# EAGLE design RGBW_LED-Band_Treiber_ungueltig (EAGLE 6.1)

## Sheet 1 of 2
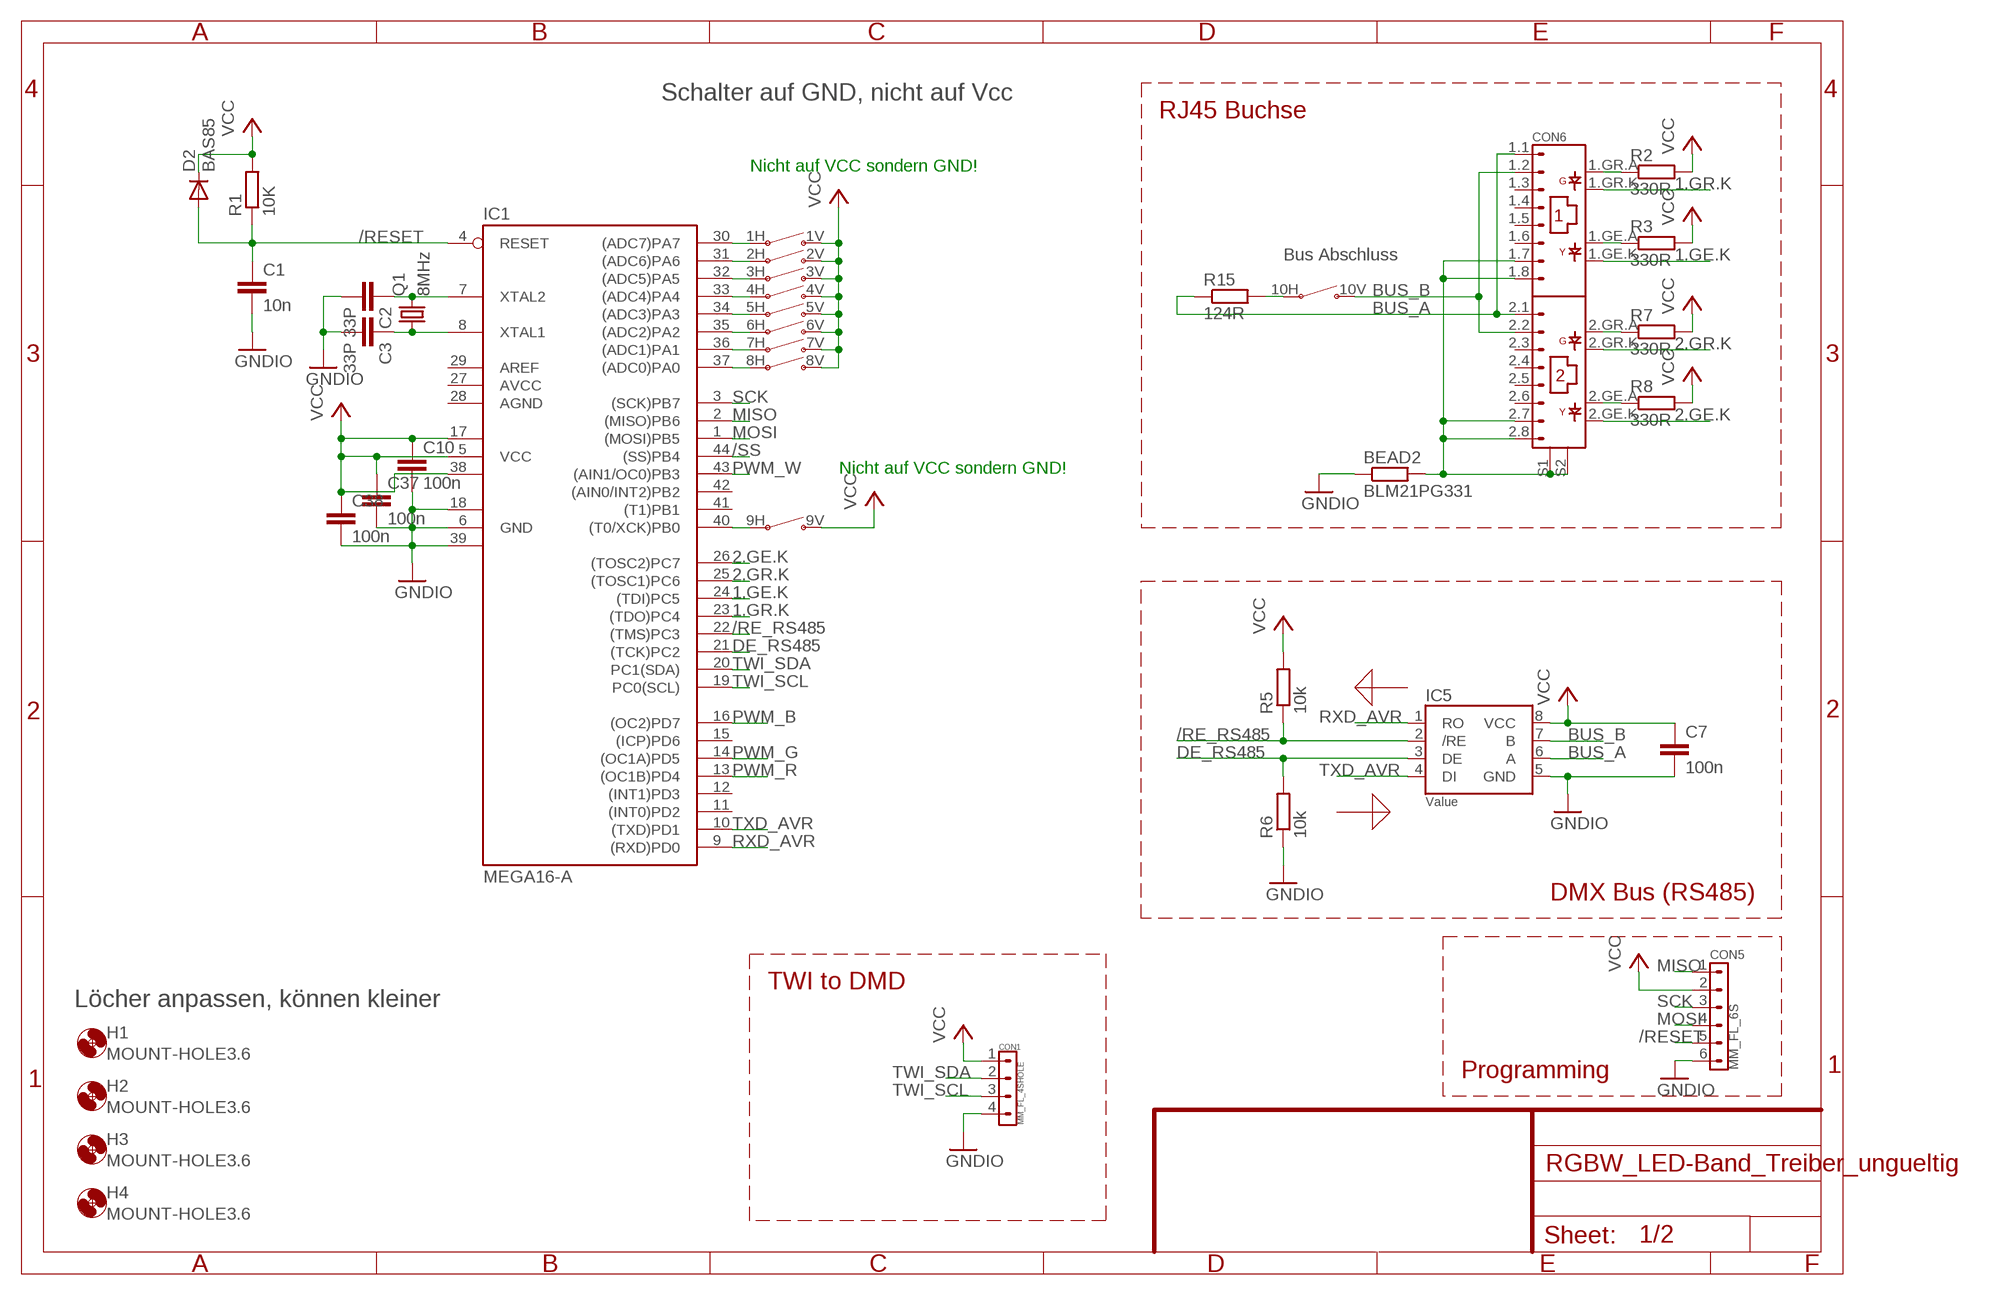
[diagram p0: schematic, sheet 1]

### Parts
BEAD2  BLM21PG331  R-EU_R0805  [R0805]
C1  10n  C-EUC0805  [C0805]
C2  33P  C-EUC0805  [C0805]
C3  33P  C-EUC0805  [C0805]
C7  100n  C-EUC0805  [C0805]
C10  100n  C-EUC0805  [C0805]
C37  100n  C-EUC0805  [C0805]
C38  100n  C-EUC0805  [C0805]
CON1  MM_FL_4SHOLE  [MM_FL_4G]
CON5  MM_FL_6S  MM_FL_6STH  [MM_FL_6G]
CON6  RJ45_2ER_LED  [RJ45_2ER_LED]
D2  BAS85  DIODE-SOD80C  [SOD80C]
H1  MOUNT-HOLE3.6  [3,6]
H2  MOUNT-HOLE3.6  [3,6]
H3  MOUNT-HOLE3.6  [3,6]
H4  MOUNT-HOLE3.6  [3,6]
IC1  MEGA16-A  [TQFP44]
IC5  LT1785  [SO08]
Q1  8MHz  CRYTALHC49S  [HC49/S]
R1  10K  R-EU_R0805  [R0805]
R2  330R  R-EU_R0805  [R0805]
R3  330R  R-EU_R0805  [R0805]
R5  10k  R-EU_R0805  [R0805]
R6  10k  R-EU_R0805  [R0805]
R7  330R  R-EU_R0805  [R0805]
R8  330R  R-EU_R0805  [R0805]
R15  124R  R-EU_R0805  [R0805]
S1  DIP-SCHALTERPIANO  [DP_10]

### Nets
1.GE.K: CON6.1.GE.K IC1.24((TDI)PC5)
1.GR.K: CON6.1.GR.K IC1.23((TDO)PC4)
2.GE.K: CON6.2.GE.K IC1.26((TOSC2)PC7)
2.GR.K: CON6.2.GR.K IC1.25((TOSC1)PC6)
/RE_RS485: IC1.22((TMS)PC3) IC5.2(/RE) R5.1
/RESET: C1.1 CON5.5 D2.A IC1.4(RESET) R1.1
/SS: IC1.44((SS)PB4)
BUS_A: CON6.1.1 CON6.2.1 IC5.6(A) R15.1
BUS_B: CON6.1.2 CON6.2.2 IC5.7(B) S1.10V
DE_RS485: IC1.21((TCK)PC2) IC5.3(DE) R6.2
GNDIO: BEAD2.1 C1.2 C2.2 C3.2 C7.2 C10.2 C37.2 C38.2 CON1.4 CON5.6 IC1.6(GND) IC1.18(GND1) IC1.39(GND2) IC5.5(GND) R6.1 ; also sheet 2
MISO: CON5.1 IC1.2((MISO)PB6)
MOSI: CON5.4 IC1.1((MOSI)PB5)
N$1: C3.1 IC1.8(XTAL1) Q1.1
N$2: C2.1 IC1.7(XTAL2) Q1.2
N$3: IC1.30((ADC7)PA7) S1.1H
N$4: IC1.31((ADC6)PA6) S1.2H
N$5: IC1.32((ADC5)PA5) S1.3H
N$7: IC1.33((ADC4)PA4) S1.4H
N$8: IC1.34((ADC3)PA3) S1.5H
N$9: IC1.35((ADC2)PA2) S1.6H
N$10: IC1.36((ADC1)PA1) S1.7H
N$11: IC1.37((ADC0)PA0) S1.8H
N$13: BEAD2.2 CON6.1.7 CON6.1.8 CON6.2.7 CON6.2.8 CON6.S1 CON6.S2
N$14: CON6.1.GR.A R2.1
N$16: CON6.1.GE.A R3.1
N$18: CON6.2.GR.A R7.1
N$20: CON6.2.GE.A R8.1
N$25: IC1.40((T0/XCK)PB0) S1.9H
N$27: R15.2 S1.10H
PWM_B: IC1.16((OC2)PD7) ; also sheet 2
PWM_G: IC1.14((OC1A)PD5) ; also sheet 2
PWM_R: IC1.13((OC1B)PD4) ; also sheet 2
PWM_W: IC1.43((AIN1/OC0)PB3) ; also sheet 2
RXD_AVR: IC1.9((RXD)PD0) IC5.1(RO)
SCK: CON5.3 IC1.3((SCK)PB7)
TWI_SCL: CON1.3 IC1.19(PC0(SCL))
TWI_SDA: CON1.2 IC1.20(PC1(SDA))
TXD_AVR: IC1.10((TXD)PD1) IC5.4(DI)
VCC: C7.1 C10.1 C37.1 C38.1 CON1.1 CON5.2 D2.C IC1.5(VCC) IC1.17(VCC1) IC1.38(VCC2) IC5.8(VCC) R1.2 R2.2 R3.2 R5.2 R7.2 R8.2 S1.1V S1.2V S1.3V S1.4V S1.5V S1.6V S1.7V S1.8V S1.9V ; also sheet 2
Unconnected: CON6.1.3 CON6.1.4 CON6.1.5 CON6.1.6 CON6.2.3 CON6.2.4 CON6.2.5 CON6.2.6 IC1.11((INT0)PD2) IC1.12((INT1)PD3) IC1.15((ICP)PD6) IC1.41((T1)PB1) IC1.42((AIN0/INT2)PB2)

### Notes on the sheet
- Schalter auf GND, nicht auf Vcc
- RJ45 Buchse
- Nicht auf VCC sondern GND!
- Bus Abschluss
- Nicht auf VCC sondern GND!
- DMX Bus (RS485)
- TWI to DMD
- Löcher anpassen, können kleiner
- Programming

## Sheet 2 of 2
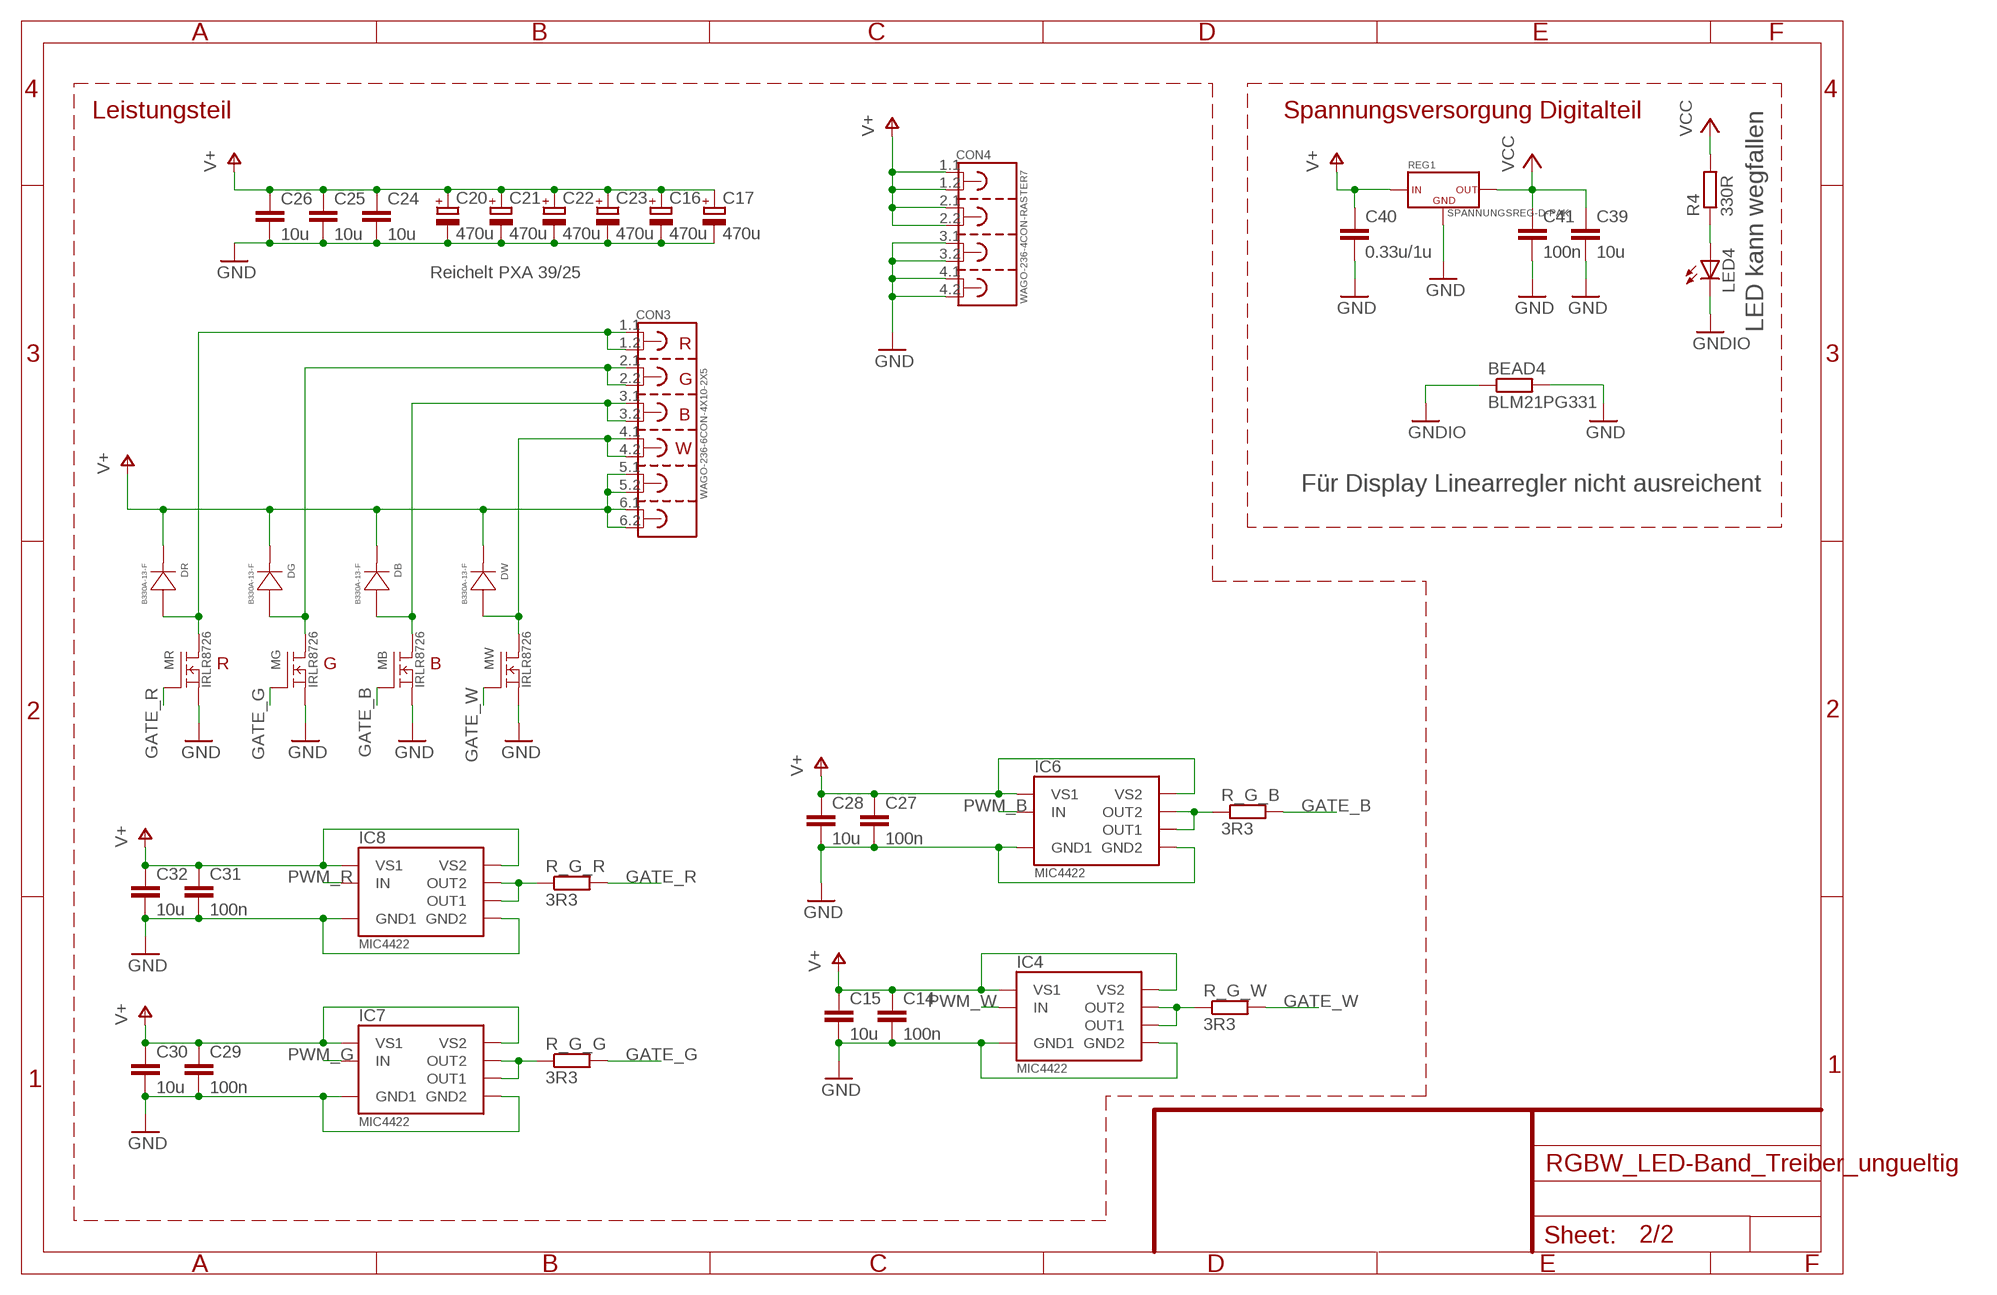
[diagram p1: schematic, sheet 2]

### Parts
BEAD4  BLM21PG331  R-EU_R0805  [R0805]
C14  100n  C-EUC0805  [C0805]
C15  10u  C-EUC0805  [C0805]
C16  470u  CPOL-EUE5-10.5  [E5-10,5]
C17  470u  CPOL-EUE5-10.5  [E5-10,5]
C20  470u  CPOL-EUE5-10.5  [E5-10,5]
C21  470u  CPOL-EUE5-10.5  [E5-10,5]
C22  470u  CPOL-EUE5-10.5  [E5-10,5]
C23  470u  CPOL-EUE5-10.5  [E5-10,5]
C24  10u  C-EUC0805  [C0805]
C25  10u  C-EUC0805  [C0805]
C26  10u  C-EUC0805  [C0805]
C27  100n  C-EUC0805  [C0805]
C28  10u  C-EUC0805  [C0805]
C29  100n  C-EUC0805  [C0805]
C30  10u  C-EUC0805  [C0805]
C31  100n  C-EUC0805  [C0805]
C32  10u  C-EUC0805  [C0805]
C39  10u  C-EUC0805  [C0805]
C40  0.33u/1u  C-EUC0805  [C0805]
C41  100n  C-EUC0805  [C0805]
CON3  WAGO-236-6CON-4X10-2X5  [WAGO236_2X5_4X10]
CON4  WAGO-236-4CON-RASTER7  [WAGO236_7.5_4]
DB  B330A-13-F  [SMA]
DG  B330A-13-F  [SMA]
DR  B330A-13-F  [SMA]
DW  B330A-13-F  [SMA]
IC4  MIC4422  [SO08]
IC6  MIC4422  [SO08]
IC7  MIC4422  [SO08]
IC8  MIC4422  [SO08]
LED4  LEDCHIP-LED0805  [CHIP-LED0805]
MB  IRLR8726  [D-PAK]
MG  IRLR8726  [D-PAK]
MR  IRLR8726  [D-PAK]
MW  IRLR8726  [D-PAK]
R4  330R  R-EU_R0805  [R0805]
R_G_B  3R3  R-EU_R0805  [R0805]
R_G_G  3R3  R-EU_R0805  [R0805]
R_G_R  3R3  R-EU_R0805  [R0805]
R_G_W  3R3  R-EU_R0805  [R0805]
REG1  SPANNUNGSREG-D-PAK  [D-PAK]

### Nets
GATE_B: MB.G R_G_B.2
GATE_G: MG.G R_G_G.2
GATE_R: MR.G R_G_R.2
GATE_W: MW.G R_G_W.2
GND: BEAD4.2 C14.2 C15.2 C16.- C17.- C20.- C21.- C22.- C23.- C24.2 C25.2 C26.2 C27.2 C28.2 C29.2 C30.2 C31.2 C32.2 C39.2 C40.2 C41.2 CON4.3.1 CON4.3.2 CON4.4.1 CON4.4.2 IC4.4(GND1) IC4.5(GND2) IC6.4(GND1) IC6.5(GND2) IC7.4(GND1) IC7.5(GND2) IC8.4(GND1) IC8.5(GND2) MB.S MG.S MR.S MW.S REG1.D(GND)
GNDIO: BEAD4.1 LED4.C ; also sheet 1
N$6: LED4.A R4.1
N$31: IC4.6(OUT1) IC4.7(OUT2) R_G_W.1
N$43: IC6.6(OUT1) IC6.7(OUT2) R_G_B.1
N$44: IC8.6(OUT1) IC8.7(OUT2) R_G_R.1
N$45: IC7.6(OUT1) IC7.7(OUT2) R_G_G.1
PHASE_B: CON3.3.1 CON3.3.2(3.3) DB.A MB.D
PHASE_G: CON3.2.1 CON3.2.2 DG.A MG.D
PHASE_R: CON3.1.1 CON3.1.2 DR.A MR.D
PHASE_W: CON3.4.1 CON3.4.2 DW.A MW.D
PWM_B: IC6.2(IN) ; also sheet 1
PWM_G: IC7.2(IN) ; also sheet 1
PWM_R: IC8.2(IN) ; also sheet 1
PWM_W: IC4.2(IN) ; also sheet 1
V+: C14.1 C15.1 C16.+ C17.+ C20.+ C21.+ C22.+ C23.+ C24.1 C25.1 C26.1 C27.1 C28.1 C29.1 C30.1 C31.1 C32.1 C40.1 CON3.5.1 CON3.5.2 CON3.6.1 CON3.6.2 CON4.1.1 CON4.1.2 CON4.2.1 CON4.2.2 DB.K DG.K DR.K DW.K IC4.1(VS1) IC4.8(VS2) IC6.1(VS1) IC6.8(VS2) IC7.1(VS1) IC7.8(VS2) IC8.1(VS1) IC8.8(VS2) REG1.G(IN)
VCC: C39.1 C41.1 R4.2 REG1.S(OUT) ; also sheet 1

### Notes on the sheet
- Leistungsteil | Spannungsversorgung Digitalteil
- Reichelt PXA 39/25
- LED kann wegfallen
- R
- G
- B
- W
- Für Display Linearregler nicht ausreichent
- R | G | B

## Power pins joined to a net without a drawn wire
AGND: IC1.28(AGND)
AREF: IC1.29(AREF)
AVCC: IC1.27(AVCC)

## Library data of the parts
BEAD2 BEAD4 R1-R8 R15 R_G_B R_G_G R_G_R R_G_W = rcl:R-EU_: RESISTOR, European symbol
C1-C3 C7 C10 C14 C15 C24-C32 C37-C41 = rcl:C-EU: CAPACITOR, European symbol
C16 C17 C20-C23 = rcl:CPOL-EU: POLARIZED CAPACITOR, European symbol
CON1 = marcus:MM_FL_4S: Miniatru Print Stecker SMD 4 Kontakte Reichelt Bestellnummer: MM FL 4S Created by Marcus Knips 4/2013
CON3 = marcus:WAGO-236-6CON-*: WAGO 236 Connector Kombination 4x10mm und 2x5mm Created by Marcus Knips 4/2013
CON4 = marcus:WAGO-236-4CON-*
CON5 = marcus:MM_FL_6S: Miniatru Print Stecker SMD 6 Kontakte Reichelt Bestellnummer: MM FL 6S Created by Marcus Knips 4/2013
CON6 = marcus:RJ45_2ER_LED: RJ45 doppel Platinenstecker mit LEDs FCI Connectors Farnell Bestellnummer: 2215322 Cat3 Created by Marcus Knips 4/2013
D2 = diode:DIODE-: DIODE
DB DG DR DW = marcus:B330A-13-F: B330A-13-F Schottky Diode DIODES Incorporated Vr = 30V, Id = 3A / 80A pulse Created by Marcus Knips 9/2012
H1-H4 = holes:MOUNT-HOLE: MOUNTING HOLE with drill center marker
IC1 = atmel:MEGA16: MICROCONTROLLER 16 Kbytes FLASH 1 kbytes SRAM 512 bytes EEPROM USART 8-channel 10 bit ADC Source: avr.lbr
IC4 IC6-IC8 = marcus:MIC4422: MIC4422 9A-Peak Low-Side MOSFET Driver micrel&reg Created by Marcus Knips 11/2012
IC5 = marcus:LT1785: LT1785 RS-485 Transceiver Linear Technology Ceated by Marcus Knips 11/2012
LED4 = led:LED: LED OSRAM: - CHIPLED LG R971, LG N971, LY N971, LG Q971, LY Q971, LO R971, LY R971 LH N974, LH R974 LS Q976, LO Q976, LY Q976 LO Q996 - Hyper CHIPLED LW Q18S LB Q993, LB Q99A, LB R99A - SideLED LS A670, LO A670, LY A670, LG A670, LP A670 LB A673, LV A673, LT A673, LW A673 LH A674 LY A675 LS A676, LA A676, LO A676, LY A676, LW A676 LS A679, LY A679, LG A679 - Hyper Micro SIDELED® LS Y876, LA Y876, LO Y876, LY Y876 LT Y87S - SmartLED LW L88C, LW L88S LB L89C, LB L89S, LG L890 LS L89K, LO L89K, LY L89K LS L896, LA L896, LO L896, LY L896 - TOPLED LS T670, LO T670, LY T670, LG T670, LP T670 LSG T670, LSP T670, LSY T670, LOP T670, LYG T670 LG T671, LOG T671, LSG T671 LB T673, LV T673, LT T673, LW T673 LH T674 LS T676, LA T676, LO T676, LY T676, LB T676, LH T676, LSB T676, LW T676 LB T67C, LV T67C, LT T67C, LS T67K, LO T67K, LY T67K, LW E67C LS E67B, LA E67B, LO E67B, LY E67B, LB E67C, LV E67C, LT E67C LW T67C LS T679, LY T679, LG T679 LS T770, LO T770, LY T770, LG T770, LP T770 LB T773, LV T773, LT T773, LW T773 LH T774 LS E675, LA E675, LY E675, LS T675 LS T776, LA T776, LO T776, LY T776, LB T776 LHGB T686 LT T68C, LB T68C - Hyper Mini TOPLED® LB M676 - Mini TOPLED Santana® LG M470 LS M47K, LO M47K, LY M47K Source: http://www.osram.convergy.de/
MB MG MR MW = marcus:IRLR8726: IRLR8726 HEXFET Power MOSFET International Recifier Vdss = 30V, Id = 86A, Rds(on) = 5,8mOhm Farnell Bestellnummer: 1698305 Created by Marcus Knips 9/2012
Q1 = crystal:CRYTAL: CRYSTAL
REG1 = marcus:SPANNUNGSREG-*: Spannungsregler Created by Marcus Knips 4/2013
S1 = marcus:DIP-SCHALTER: DIP Switch 10 Mini Schalter Created by Marcus Knips 03/2013

## Board
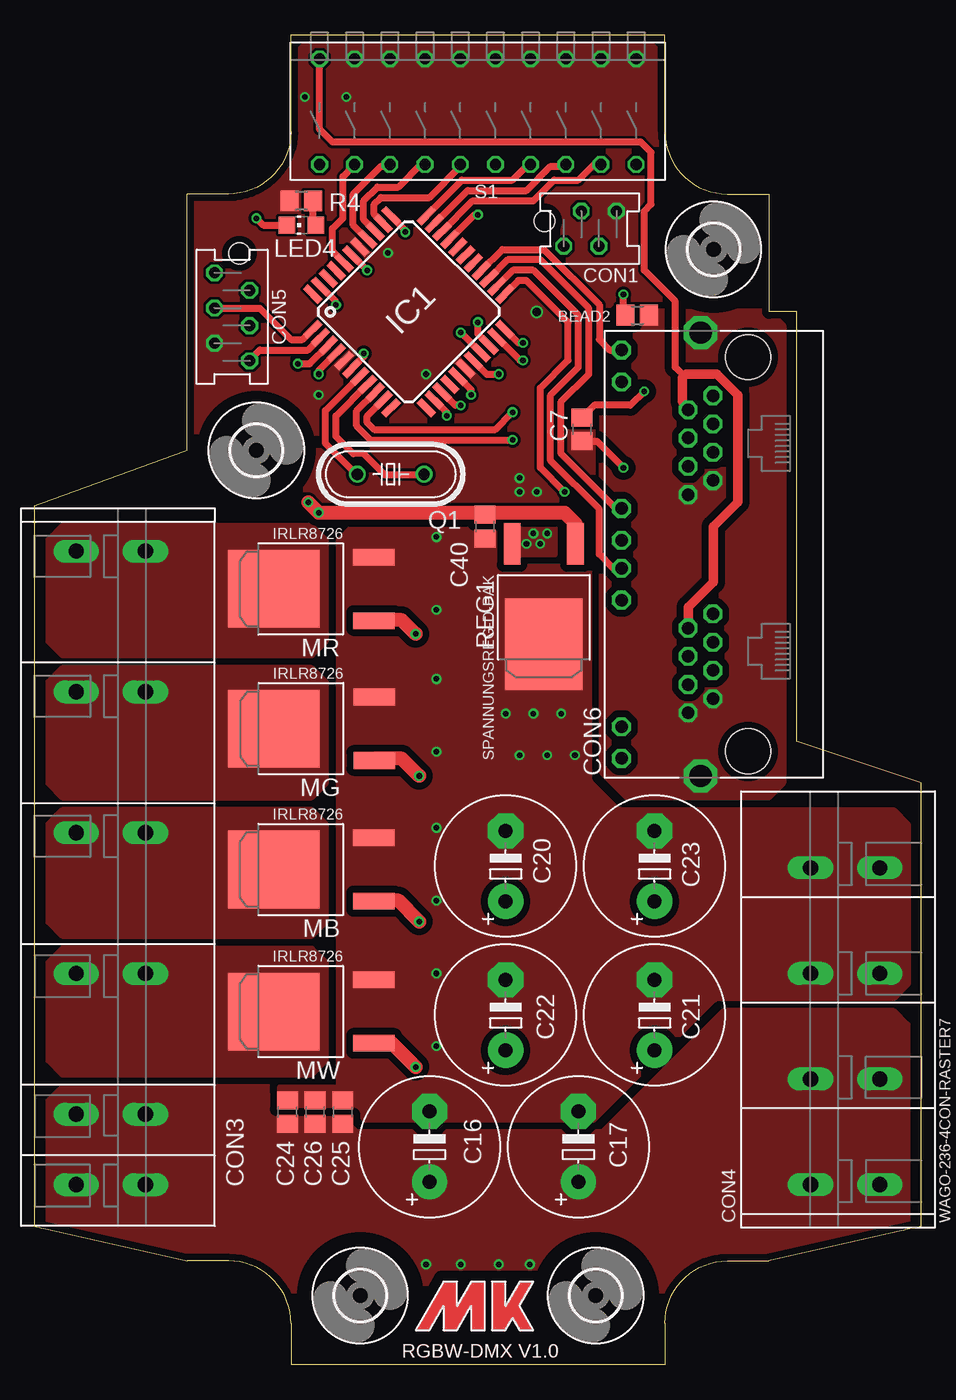
[diagram p2: board, top side]
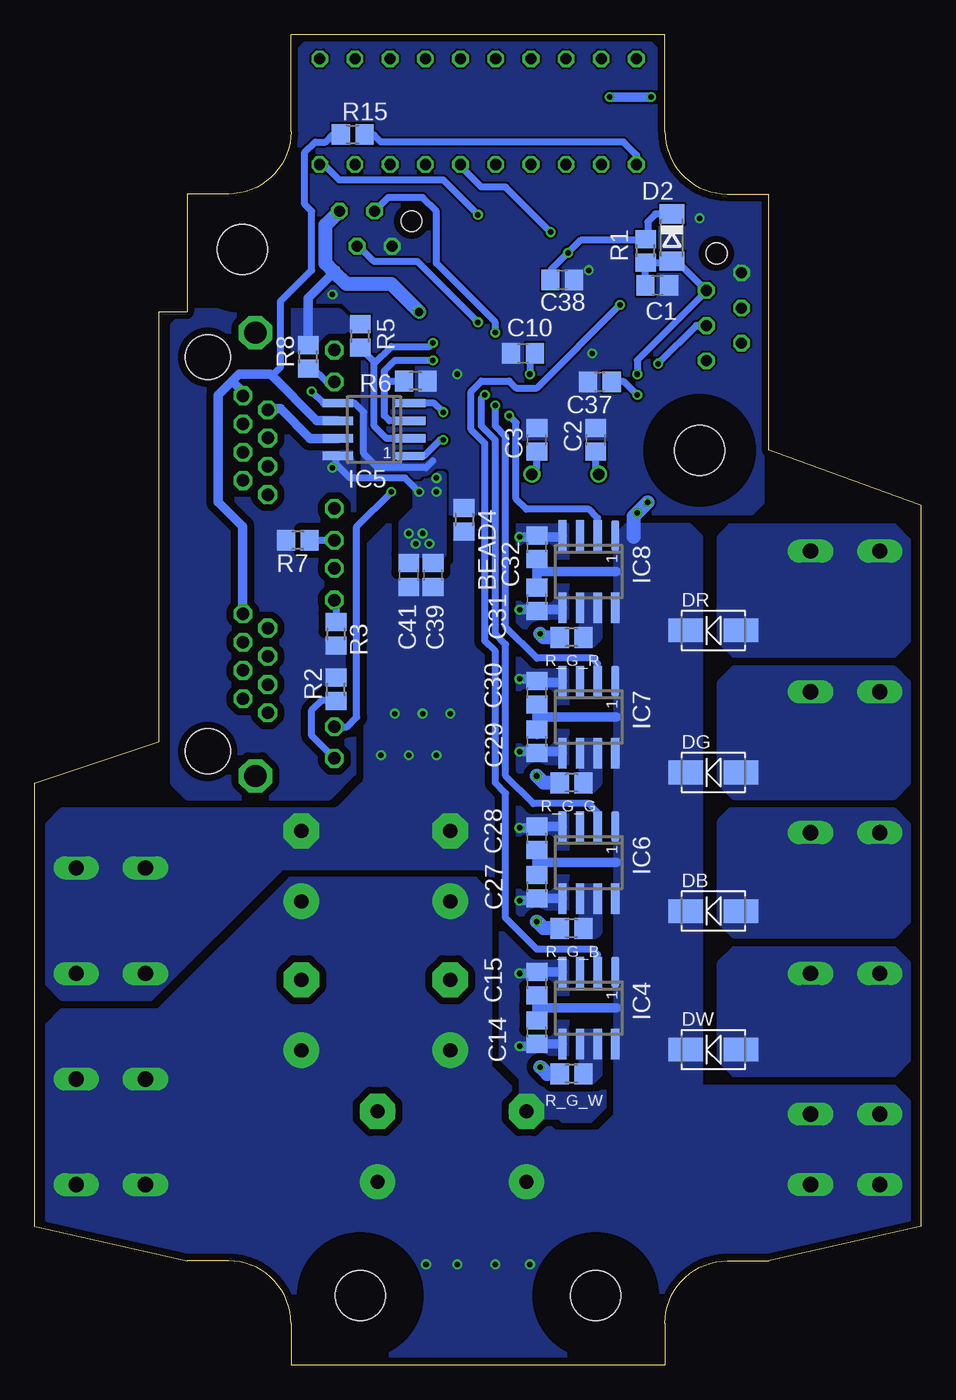
[diagram p3: board, bottom side, seen from below]

Size 64 x 96 mm. Coordinates in mm from the lower left corner, seen from the top.
Outline: 11,66 11,84.5 14,84.5 arc90 18.5,89 18.5,96 45.5,96 45.5,89 arc90 50,84.5 53,84.5 53,76 55,76 55,45 64,42 64,10 53,7.5 50,7.5 arc90 45.5,3 45.5,0 18.5,0 18.5,3 arc90 14,7.5 11,7.5 0,10 0,62 11,66
Copper layers (1*16): Top 0.035mm / dielectric 1.5mm / Bottom 0.035mm
Design rules "multi-cb_035um-cu": minimum track width 6mil, minimum drill 12mil, track to track 6mil, track to pad 6mil, pad to pad 6mil, via to via 6mil, smd to smd 6mil, copper to edge 20mil, drill to drill 8mil, minimum pad ring 8mil, minimum via ring 6mil, stop-mask expansion 3mil, vias tented up to drill 0mil, thermal gap 8mil

### Footprints (pad centres in the part's own frame; a part is rotated, then mirrored left to right if it is on the bottom)
R0805 = smd 1.3 x 1.5: 1 -0.85,0; 2 0.85,0
C0805 = smd 1.3 x 1.5: 1 -0.85,0; 2 0.85,0
E5-10,5 = drill 1.016 pad 2.54 round: + -2.54,0 | drill 1.016 pad 2.54 octagon: - 2.54,0
MM_FL_4G = drill 0.8 octagon: 1 0,-1.27; 2 1.27,1.27; 3 2.54,-1.27; 4 3.81,1.27 | hole 1.5: 5.21,-0.53
WAGO236_2X5_4X10 = drill 1.1 long: 1.1 -30.48,0; 1.2 -30.48,-5; 2.1 -20.32,0; 2.2 -20.32,-5; 3.1 -10.16,0; 3.2 -10.16,-5; 4.1 0,0; 4.2 0,-5; 5.1 10.16,0; 5.2 10.16,-5; 6.1 15.24,0; 6.2 15.24,-5
WAGO236_7.5_4 = drill 1.1 long: 1.1 -15.24,0; 1.2 -15.24,-5; 2.1 -7.62,0; 2.2 -7.62,-5; 3.1 0,0; 3.2 0,-5; 4.1 7.62,0; 4.2 7.62,-5
MM_FL_6G = drill 0.8 octagon: 1 -2.54,-1.27; 2 -1.27,1.27; 3 0,-1.27; 4 1.27,1.27; 5 2.54,-1.27; 6 3.81,1.27 | hole 1.5: 5.21,-0.53
RJ45_2ER_LED = drill 0.9 octagon: 1.1 -4.305,2.54; 1.2 -5.325,4.32; 1.3 -6.345,2.54; 1.4 -7.365,4.32; 1.5 -8.385,2.54; 1.6 -9.405,4.32; 1.7 -10.425,2.54; 1.8 -11.445,4.32; 1.GE.A -3.305,9.14; 1.GE.K -1.015,9.14; 1.GR.A -14.735,9.14; 1.GR.K -12.445,9.14; 2.1 11.445,2.54; 2.2 10.425,4.32; 2.3 9.405,2.54; 2.4 8.385,4.32; 2.5 7.365,2.54; 2.6 6.345,4.32; 2.7 5.325,2.54; 2.8 4.305,4.32; 2.GE.A 12.445,9.14; 2.GE.K 14.735,9.14; 2.GR.A 1.015,9.14; 2.GR.K 3.305,9.14 | drill 1.6 octagon: S1 -16,3.43; S2 16,3.43 | hole 3.25: -14.225,0; 14.225,0
SOD80C = smd 1.4 x 1.8: A 1.7,0; C -1.7,0
SMA = smd 2.5 x 1.7: A 2,0; K -2,0
3,6 = hole 3.6: 0,0
TQFP44 = smd 1.5 x 0.5: 1 -5.8,4; 2 -5.8,3.2; 3 -5.8,2.4; 4 -5.8,1.6; 5 -5.8,0.8; 6 -5.8,0; 7 -5.8,-0.8; 8 -5.8,-1.6; 9 -5.8,-2.4; 10 -5.8,-3.2; 11 -5.8,-4; 23 5.8,-4; 24 5.8,-3.2; 25 5.8,-2.4; 26 5.8,-1.6; 27 5.8,-0.8; 28 5.8,0; 29 5.8,0.8; 30 5.8,1.6; 31 5.8,2.4; 32 5.8,3.2; 33 5.8,4 | smd 0.5 x 1.5: 12 -4,-5.8; 13 -3.2,-5.8; 14 -2.4,-5.8; 15 -1.6,-5.8; 16 -0.8,-5.8; 17 0,-5.8; 18 0.8,-5.8; 19 1.6,-5.8; 20 2.4,-5.8; 21 3.2,-5.8; 22 4,-5.8; 34 4,5.8; 35 3.2,5.8; 36 2.4,5.8; 37 1.6,5.8; 38 0.8,5.8; 39 0,5.8; 40 -0.8,5.8; 41 -1.6,5.8; 42 -2.4,5.8; 43 -3.2,5.8; 44 -4,5.8
SO08 = smd 0.6 x 2.2: 1 -1.905,-2.6; 2 -0.635,-2.6; 3 0.635,-2.6; 4 1.905,-2.6; 5 1.905,2.6; 6 0.635,2.6; 7 -0.635,2.6; 8 -1.905,2.6
CHIP-LED0805 = smd 1.2 x 1.2: A 0,-1.05; C 0,1.05
D-PAK = smd 5.6 x 6.6: D 0,5 | smd 1.2 x 3: G -2.29,-2.24; S 2.29,-2.24
HC49/S = drill 0.813 round: 1 -2.413,0; 2 2.413,0
DP_10 = drill 0.8 octagon: 1H -12.7,2.54; 1V -12.7,-5.08; 2H -10.16,2.54; 2V -10.16,-5.08; 3H -7.62,2.54; 3V -7.62,-5.08; 4H -5.08,2.54; 4V -5.08,-5.08; 5H -2.54,2.54; 5V -2.54,-5.08; 6H 0,2.54; 6V 0,-5.08; 7H 2.54,2.54; 7V 2.54,-5.08; 8H 5.08,2.54; 8V 5.08,-5.08; 9H 7.62,2.54; 9V 7.62,-5.08; 10H 10.16,2.54; 10V 10.16,-5.08

### Placement (x,y rotation side)
BEAD2  43.5,75.75 0 top
BEAD4  33,61 270 bottom
C1  19.05,77.9 0 bottom
C2  23.5,66.75 90 bottom
C3  27.75,66.75 90 bottom
C7  39.5,67.5 90 top
C10  28.75,73 180 bottom
C14  27.75,24 270 bottom
C15  27.75,27.5 90 bottom
C16  28.5,15.75 90 top
C17  39.25,15.75 90 top
C20  34,36 90 top
C21  44.75,25.25 90 top
C22  34,25.25 90 top
C23  44.75,36 90 top
C24  18.25,18.25 90 top
C25  22.25,18.25 90 top
C26  20.25,18.25 90 top
C27  27.75,34.5 270 bottom
C28  27.75,38 90 bottom
C29  27.75,45 270 bottom
C30  27.75,48.5 90 bottom
C31  27.75,55.25 270 bottom
C32  27.75,59 90 bottom
C37  23.2,70.95 180 bottom
C38  25.91,78.29 0 bottom
C39  35.25,57 270 bottom
C40  32.5,60.5 270 top
C41  37,57 270 bottom
CON1  42,82 180 top
CON3  8,28.25 270 top
CON4  56,28.25 90 top
CON5  14.25,75 90 top
CON6  51.5,58.5 90 top
D2  18,81.35 270 bottom
DB  15,32.75 0 bottom
DG  15,42.75 0 bottom
DR  15,53 0 bottom
DW  15,22.75 0 bottom
H1  23.5,5 0 top
H2  40.5,5 0 top
H3  16,66 0 top
H4  49,80.5 0 top
IC1  27,76 45 top
IC4  24,25.75 180 bottom
IC5  39.5,67.5 90 bottom
IC6  24,36.25 180 bottom
IC7  24,46.75 180 bottom
IC8  24,57.25 180 bottom
LED4  19.25,82.25 90 top
MB  22.25,35.75 90 top
MG  22.27,45.91 90 top
MR  22.25,56 90 top
MW  22.25,25.5 90 top
Q1  25.7,64.27 180 top
R1  19.9,80.4 90 bottom
R2  42.25,48.75 90 bottom
R3  42.25,52.75 270 bottom
R4  19.25,84 180 top
R5  40.5,74.25 90 bottom
R6  36.5,71 180 bottom
R7  45,59.5 180 bottom
R8  44.25,72.75 90 bottom
R15  41.05,88.8 0 bottom
R_G_B  25.25,31.5 180 bottom
R_G_G  25.25,42 180 bottom
R_G_R  25.25,52.5 180 bottom
R_G_W  25.25,21 180 bottom
REG1  36.75,57 180 top
S1  30.72,89.17 180 top
U$1  [LOGO2]  30.5,2.5 0 top

### Tracks (layer width: path | path; a pad name or v marks a point on that pad's centre or on a via)
1.GE.K
  Top 0.5: IC1.24 34.53,79 36,79 39.25,75.75 39.25,72 37.25,70 37.25,65.25 40.75,61.75 40.75,58.5 41.75,57.5 42.38,57.5 | 42.38,57.5 42.5,57.5 | 42.38,57.5 CON6.1.GE.K
1.GR.K  (via drill 0.4)
  Top 0.5: IC1.23 34.91,78.25 35.5,78.25 38.5,75.25 38.5,72.5 36.5,70.5 36.5,64.75 v38.25,63
  Bottom 0.5: CON6.1.GR.K 42.3,46.05 42.25,46 41.5,46 40.75,46.75 40.75,60.5 v38.25,63
2.GE.K
  Top 0.5: IC1.26 33.76,80.5 36.75,80.5 40.75,76.5 40.75,74 41.5,73.25 42.38,73.25 | 42.38,73.25 42.5,73.25 | 42.38,73.25 CON6.2.GE.K
2.GR.K
  Top 0.5: IC1.25 34.14,79.75 36.5,79.75 40,76.25 40,71.5 38,69.5 38,65.75 42,61.75 42.41,61.75 | 42.41,61.75 42.5,61.75 | 42.41,61.75 CON6.2.GR.K
/RE_RS485  (via drill 0.4)
  Top 0.5: IC1.22 34.91,73.75 v35.25,73.75
  Bottom 0.5: IC5.2 38.62,66.86 39.5,67.75 39.5,72.25 | 39.5,72.25 38.25,73.5 35.5,73.5 v35.25,73.75 | R5.1 39.5,72.4 39.5,72.25
/RESET  (via drill 0.4)
  Top 0.5: IC1.4 20.5,71.76 v20.5,71.5
  Bottom 0.5: 15.52,77.52 15.5,77.5 20.5,72.5 v20.5,71.5 | CON5.5 15.52,77.52 | 15.52,77.52 17.75,79.75 18,79.75 D2.A 18.15,79.5 19.95,79.5 | 19.95,79.5 20,79.5 | 19.95,79.5 R1.1 | 19.95,77.8 19.9,77.85 C1.1 | 19.95,79.5 19.95,77.8 | 19.95,77.8 20,77.75
BUS_A
  Bottom 0.5: R15.1 42.45,88.8 43,88.25 43.75,88.25 44.5,87.5 44.5,83.75 44,83.25 44,79 46.25,76.75 46.25,72 46.88,71.38
  Bottom 0.7: CON6.1.1 49,54.25 49,60.5 50.75,62.25 50.75,70 49.75,71 | 48.96,69.96 CON6.2.1 48.96,70.21 49.75,71 | IC5.6 43.63,68.14 46.88,71.38 47,71.5 49.25,71.5 49.75,71
BUS_B
  Top 0.5: S1.10V 20.56,89.19 21.5,88.25 43.75,88.25 44.5,87.5 44.5,83.75 44,83.25 44,79 46.25,76.75 46.25,72 46.75,71.5 47,71.5
  Top 0.7: CON6.1.2 47.18,54.68 49,56.5 49,60.5 50.75,62.25 50.75,70 49.25,71.5 47,71.5 46.75,71.25 46.75,69.5 47.25,69 CON6.2.2
  Bottom 0.7: CON6.2.2 47.25,69 46.25,69 44.12,66.86 IC5.7
DE_RS485  (via drill 0.4)
  Top 0.5: IC1.21 35.02,72.5 v35.25,72.5
  Bottom 0.5: IC5.3 38.38,68.14 38.75,68.5 38.75,71 | 38.75,71 R6.2 | 38.75,71 38.75,71.75 38,72.5 v35.25,72.5
GATE_B  (via drill 0.4)
  Top 1: v27.75,32 26.25,33.5 24.5,33.5 24.49,33.49 MB.G
  Bottom 1: R_G_B.2 27.25,31.5 v27.75,32
GATE_G  (via drill 0.4)
  Top 1: MG.G 24.5,43.75 26.5,43.75 v27.75,42.5
  Bottom 1: R_G_G.2 27.25,42 v27.75,42.5
GATE_R  (via drill 0.4)
  Top 1: 24.45,53.75 24.25,53.75 | 24.45,53.75 MR.G | v27.5,52.75 26.5,53.75 24.45,53.75
  Bottom 1: R_G_R.2 27.25,52.5 v27.5,52.75
GATE_W  (via drill 0.4)
  Top 1: v27.5,21.5 25.75,23.25 24.5,23.25 24.49,23.24 MW.G
  Bottom 1: R_G_W.2 27,21 v27.5,21.5
GND  (via drill 0.4)
  Bottom 0.7: IC4.4 27.65,28.35 27.75,28.25 C15.2 27.85,28.25 v29,28.25 | IC4.5 27.65,23.15 27.75,23.25 C14.2 27.9,23 v29,23 | IC6.4 27.65,38.85 27.75,38.75 C28.2 27.85,38.75 v29,38.75 | IC6.5 27.65,33.65 27.75,33.75 C27.2 27.9,33.5 v29,33.5 | IC7.4 26.01,49.25 27.75,49.25 C30.2 27.9,49.5 v29,49.5 | IC7.5 26.01,44.25 27.75,44.25 C29.2 27.85,44.25 v29,44.25 | 27.75,54.5 C31.2 | IC8.5 26.05,54.5 27.75,54.5 | 27.85,59.75 28,59.75 | IC8.4 26.01,59.75 27.85,59.75 | 27.75,54.5 v29,54.5 | 27.85,59.75 C32.2 | 27.85,59.75 v29,59.75
  other vias: 34,47 36,47 38,47 35,44 37,44 39,44
  pour Top (isolate 0.5, rank 5, no thermals): 62,26.5 49.5,26.5 40.25,17.25 24.25,17.25 22,19.5 22,59.5 23,60.5 38.5,60.5 40,59 40,42.25 42.25,40 62,40 63,39 63,27.5
  pour Bottom (isolate 0.5, rank 6, no thermals): 63,39 62,40 42.25,40 40,42.25 40,59 38.5,60.5 23,60.5 22,59.5 22,19.5 24.25,17.25 40.25,17.25 49.5,26.5 62,26.5 63,27.5
  pour Top (isolate 0.2, rank 3, no thermals): 17.75,20 22.75,20 22.75,18.75 17.75,18.75
GNDIO  (via drill 0.4)
  Top 0.5: IC1.39 v24,79 | IC1.6 23.75,72.75 v23.75,73 | IC1.18 32.63,71.5 v33.5,71.5 | LED4.C 16.5,82.25 v16,82.75 | C7.2 40.4,69.25 43,69.25 v44,70.25 | BEAD2.1 42.5,75.75 v42.5,77.25
  Bottom 0.5: 35.25,65.25 35.75,64.75 39.25,64.75 40.25,65.75 40.25,68.75 40.91,69.41 IC5.5 43.16,69.41 v44,70.25
  pour Bottom (rank 6, no thermals): 11.5,84 11.5,62.25 12.25,61.5 39.75,61.5 40.25,62 40.25,75.25 41.75,76.75 51.75,76.75 52.5,77.5 52.5,84 50,84 arc-90 45,89 45,94.75 44.25,95.5 19.75,95.5 19,94.75 19,89 arc-90 14,84
MISO
  Top 0.5: IC1.2 19.72,73.25 16.25,73.25 15.5,72.5 15.52,72.48 CON5.1
MOSI
  Top 0.5: IC1.1 19.34,74 18.5,74 16.25,76.25 13,76.25 CON5.4
N$1
  Top 0.5: IC1.8 21.75,68.49 21.75,67 23,65.75 23.75,65.75 25.25,64.25 28.14,64.25 | 28.14,64.25 28.25,64.25 | 28.14,64.25 Q1.1
  Bottom 0.5: 28.23,64.27 28.25,64.25 | Q1.1 28.23,64.27 | C3.1 27.75,64.75 28.23,64.27
N$2
  Top 0.5: IC1.7 21,68.87 21,66.5 23.25,64.25 23.26,64.25 Q1.2
  Bottom 0.5: 23.27,64.27 23.25,64.25 | Q1.2 23.27,64.27 | C2.1 23.5,64.5 23.27,64.27
N$3  (via drill 0.4)
  Top 0.5: IC1.30 31.74,83 v32,83
  Bottom 0.4: 43.5,86.75 43.5,86.71
  Bottom 0.5: 43.5,86.71 S1.1H | 43.5,86.75 43.25,86.75 42,85.5 34.5,85.5 v32,83
N$4
  Top 0.5: IC1.31 31.61,84 36,84 37.5,85.5 39.25,85.5 40.5,86.75 40.76,86.75 S1.2H
N$5
  Top 0.4: IC1.32 28.86,82.36
  Top 0.5: 28.86,82.36 31.25,84.75 35.5,84.75 37.25,86.5 38.25,86.5 38.34,86.59 S1.3H
N$6
  Top 0.5: LED4.A 20.25,82.25 20.1,82.4 R4.1
N$7
  Top 0.4: 35.75,86.75 35.8,86.7
  Top 0.5: IC1.33 30.84,85.5 34.5,85.5 35.75,86.75 | 35.8,86.7 S1.4H
N$8  (via drill 0.4)
  Top 0.5: IC1.34 26.75,81.91 v26.75,81.75
  Bottom 0.5: v26.75,81.75 30,85 31.75,85 33.25,86.5 S1.5H | S1.5H 33.25,86.75 | S1.5H
N$9
  Top 0.5: IC1.35 24.5,83.03 24.5,83.75 25,84.25 28.5,84.25 30.75,86.5 30.72,86.53 S1.6H
N$10
  Top 0.5: IC1.36 23.75,82.64 23.75,84 24.75,85 26.25,85 28,86.75 28.25,86.75 28.25,86.7 S1.7H
N$11
  Top 0.5: IC1.37 23,82.26 23,84.5 25,86.5 25.75,86.5 25.75,86.52 S1.8H
N$13
  pour Top (isolate 0.5, no thermals): 43,76 53,76 54,75 54,42 53,41 42.75,41 41,42.75 41,75 42,76
N$14
  Bottom 0.5: CON6.1.GR.A 44,45.41 44,47.25 43.25,48 42.25,48 R2.1
N$16
  Bottom 0.5: 42.25,53.5 R3.1 42.25,55.09 CON6.1.GE.A
N$18
  Bottom 0.5: 44.25,59.5 R7.1 42.38,59.5 CON6.2.GR.A
N$20
  Bottom 0.5: R8.1 44.1,71.9 44,72 42.95,70.94 CON6.2.GE.A
N$25
  Top 0.5: IC1.40 21.5,80.37 21.5,82 22.25,82.75 22.25,85.75 23,86.5 23,86.73 | 23,86.73 23,86.75 | 23,86.73 S1.9H
N$27
  Bottom 0.5: S1.10H 20.56,87.31 21.5,88.25 39,88.25 39.5,88.75 40.25,88.75 R15.2
N$31
  pour Bottom (isolate 0.2, no thermals): 23.25,24 24.5,24 24.5,20.5 23.75,20.5 23.25,21
N$43
  pour Bottom (isolate 0.2, no thermals): 23.25,34.5 24.5,34.5 24.5,31 23.5,31 23.25,31.25
N$44
  pour Bottom (isolate 0.2, no thermals): 23.25,55.5 24.5,55.5 24.5,52.25 24.75,52 23.75,52 23.25,52.5
N$45
  pour Bottom (isolate 0.2, no thermals): 23.25,45 24.5,45 24.5,41.5 23.75,41.5 23.25,42
PHASE_B
  pour Top (isolate 0.5, no thermals): 21,39 20,40 2,40 1,39 1,32.5 1,32 2,31 20,31 21,32
  pour Bottom (isolate 0.5, rank 2, no thermals): 2,31 13.5,31 14.5,32 14.5,39.25 13.75,40 2,40 1,39 1,32
PHASE_G
  pour Top (isolate 0.5, no thermals): 21,49.25 20,50.25 2,50.25 1,49.25 1,42 2,41 20,41 21,42
  pour Bottom (isolate 0.5, rank 2, no thermals): 2,41 13.5,41 14.5,42 14.5,49.25 13.5,50.25 2,50.25 1,49.25 1,42
PHASE_R
  pour Top (isolate 0.5, no thermals): 21,59.5 20,60.5 2,60.5 1,59.5 1,52.25 2,51.25 20,51.25 21,52.25
  pour Bottom (isolate 0.5, rank 2, no thermals): 2,51.25 13.5,51.25 14.5,52.25 14.5,59.75 13.75,60.5 2,60.5 1,59.5 1,52.25
PHASE_W
  pour Top (isolate 0.5, no thermals): 21,29 20,30 2,30 1,29 1,22 2,21 20,21 21,22
  pour Bottom (isolate 0.5, rank 2, no thermals): 2,21 13.5,21 14.5,22 14.5,29 13.5,30 2,30 1,29 1,22
PWM_B  (via drill 0.4)
  Top 0.5: IC1.16 31.5,70.37 v31.5,70
  Bottom 0.5: IC6.2 23.37,39.87 24,40.5 28,40.5 30,42.5 30,52 30.75,52.75 30.75,66.75 31.75,67.75 31.75,69.75 v31.5,70
PWM_G  (via drill 0.4)
  Top 0.5: IC1.14 30.36,69.25 v30.75,69.25
  Bottom 0.5: IC7.2 23.37,50.62 23.75,51 27.75,51 30,53.25 30,67 30.75,67.75 v30.75,69.25
PWM_R  (via drill 0.4)
  Top 0.5: IC1.13 29.75,68.72 v29.75,68.5
  Bottom 0.5: IC8.2 23.37,61.12 24,61.75 28.5,61.75 29.25,62.5 29.25,68 v29.75,68.5
PWM_W  (via drill 0.4)
  Top 0.5: IC1.43 21.75,76.72 v21.75,76.5
  Bottom 0.5: IC4.2 23.37,29.61 23.75,30 27.75,30 30,32.25 30,41.25 30.75,42 30.75,51.5 31.5,52.25 31.5,66.5 32.5,67.5 32.5,70.25 31.75,71 29.75,71 29.25,70.5 27.75,70.5 v21.75,76.5
RXD_AVR  (via drill 0.4)
  Top 0.5: IC1.9 23.25,68.86 23.25,67.75 24.25,66.75 v34.5,66.75
  Bottom 0.5: IC5.1 35.91,65.59 34.75,66.75 v34.5,66.75
SCK  (via drill 0.4)
  Top 0.5: IC1.3 19.86,72.25 v19,72.25
  Bottom 0.5: 15.5,75 CON5.3 16.25,75 v19,72.25
TWI_SCL  (via drill 0.4)
  Top 0.5: IC1.19 30.76,74.5 v30.75,74.5
  Bottom 0.5: v30.75,74.5 30.75,75.25 35,79.5 35,83.25 36,84.25 38.48,84.25 39.48,83.25 | 39.48,83.25 CON1.3 | 39.48,83.25 39.5,83.25
TWI_SDA  (via drill 0.4)
  Top 0.5: IC1.20 32,74.39 v32,75.25
  Bottom 0.5: v32,75.25 36.38,79.62 39.5,79.62 40.62,80.75 40.75,80.75 CON1.2
TXD_AVR  (via drill 0.4)
  Top 0.5: IC1.10 24,68.47 24,68 24.5,67.5 33.25,67.5 v34.5,68.75
  Bottom 0.5: IC5.4 35.16,69.41 v34.5,68.75
V+  (via drill 0.4)
  Top 1: REG1.G 39.04,60.71 38.25,61.5 33,61.5 | 33,61.5 C40.1 | 33,61.5 v20.5,61.5 v19.75,62.25
  Bottom 0.7: 27.75,24.75 C14.1 27.75,25.75 | 27.75,25.75 C15.1 | 22,25.75 27.75,25.75 | 27.75,35.25 C27.1 27.75,36.25 | 27.75,36.25 C28.1 | 22,36.25 27.75,36.25 | 27.75,45.5 C29.1 27.75,46.75 | 27.75,46.75 C30.1 | 22,46.75 27.75,46.75 | 27.75,58.25 C32.1 27.75,57.25 | 27.75,57.25 C31.1 | 22,57.25 27.75,57.25
  Bottom 1: v19.75,62.25 v20.5,61.5 20.75,61.25 20.75,59.75
  other vias: 35.75,7.25 33.5,7.25 30.75,7.25 28.25,7.25
  pour Bottom (isolate 0.5, rank 3, no thermals): 16,59.75 16.75,60.5 21.25,60.5 22,59.75 22,18 16,18
  pour Top (isolate 0.5, rank 4, no thermals): 63,24.5 62,25.5 49.75,25.5 41,16.75 23.25,16.75 20,20 2,20 1,19 1,10.5 11,8.25 14,8.25 arc-90 19.25,3 19.25,0.75 44.75,0.75 44.75,3 arc-90 50,8.25 53,8.25 63,10.5
  pour Bottom (isolate 0.5, rank 4, no thermals): 63,10.5 63,24.5 62,25.5 55,25.5 45.5,35 32.25,35 31.25,34 31.25,21.5 26.5,16.75 23.25,16.75 20,20 2,20 1,19 1,10.5 11,8.25 14,8.25 arc-90 19.25,3 19.25,0.75 44.75,0.75 44.75,3 arc-90 50,8.25 53,8.25
VCC  (via drill 0.4, 0.6)
  Top 0.5: C7.1 40.6,66.65 v42.5,64.75
  Bottom 0.5: D2.C 19.2,83.05 19.75,82.5 19.75,81 19.9,81.15 | 19.9,81.15 R1.2 | C37.1 21.45,70.95 v20.5,70 | C10.1 28.25,72.65 v28.25,71.5 | C38.1 26.76,78.99 v25.5,80.25 24.6,81.15 19.9,81.15 | IC5.8 42.2,65.5 42.25,65.5 42.25,65 41.25,64 37.25,64 v36.25,63
  Bottom 0.7: v19.5,91.5 v22.5,91.5 | R5.2 40.5,75 40.75,75.25 | 44.25,73.5 R8.2 44.25,77 42.38,78.88 42.25,79
  Bottom 1: CON1.1 42,83.25 43,82.25 43,79.5 42.38,78.88 41.5,78 38.25,78 v36.25,76
  other vias: 36,60 37,60 35.5,59.25 36.5,59.25 35,63 35,64
  pour Top (isolate 0.5, no thermals): 34.5,60.5 37.5,60.5 37.5,58.5 34.5,58.5
  pour Bottom (isolate 0.5, no thermals): 34.5,64.25 35.25,64.25 36,63.5 36.5,63.5 36.5,61.75 37.5,60.75 37.5,58.5 34.5,58.5
  pour Bottom (isolate 0.5, no thermals): 42,76 53,76 54,75 54,42 53,41 42.75,41 41,42.75 41,75
  pour Top (isolate 0.2, rank 6, no thermals): 11.5,84 11.5,62.25 12.25,61.5 39.75,61.5 40.25,62 40.25,75.25 41.75,76.75 51.75,76.75 52.5,77.5 52.5,84 50,84 arc-90 45,89 45,94.75 44.25,95.5 19.75,95.5 19,94.75 19,89 arc-90 14,84

### Text on the board
Top: RGBW-DMX V1.0
tPlace: RGBW-DMX V1.0